# EAGLE design untitled (EAGLE 7.4.0)
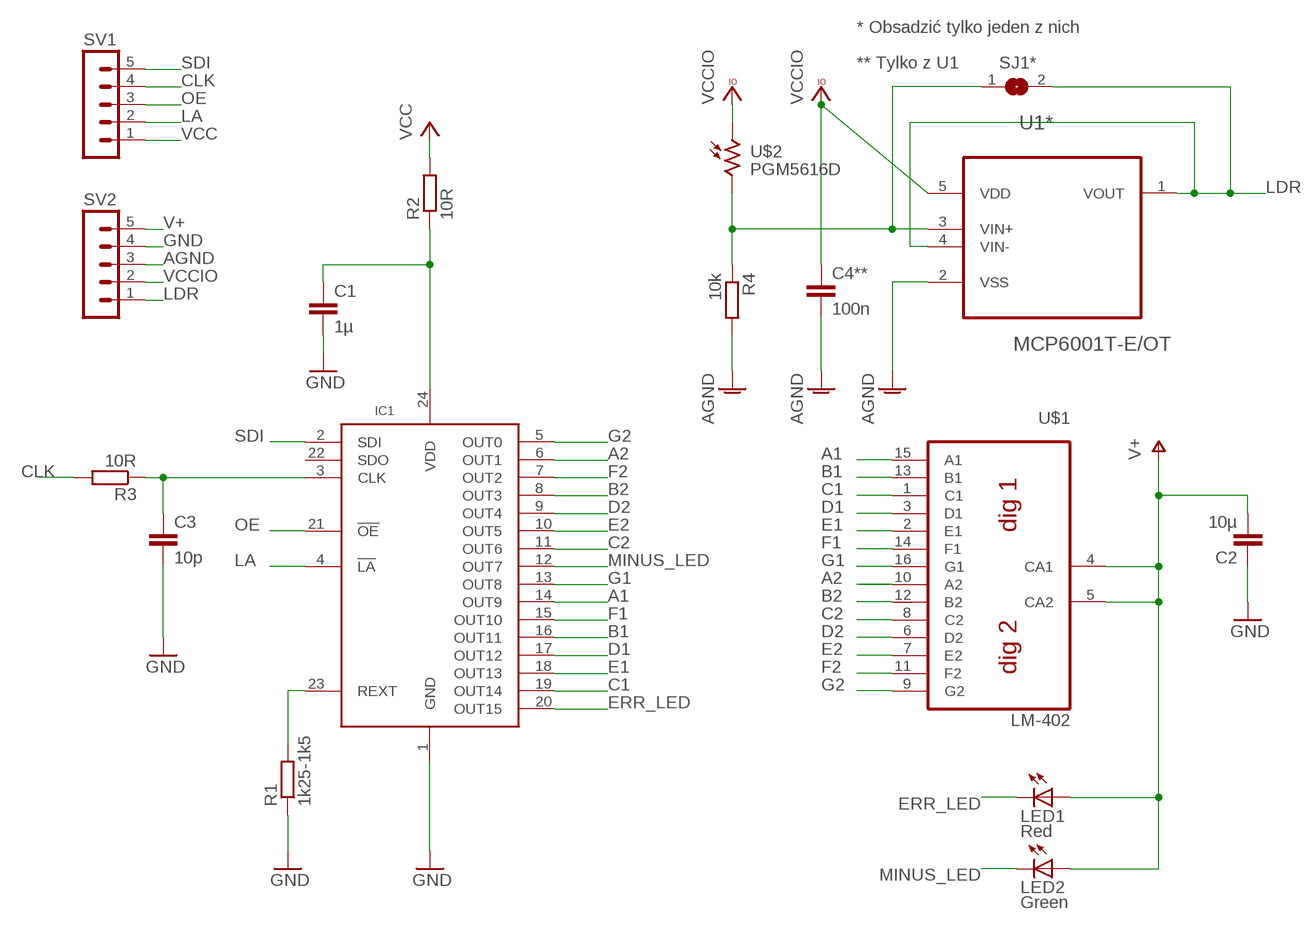
[diagram p0: schematic, sheet 1]

## Parts
C1  1µ  C-EUC0603K  [C0603K]
C2  10µ  C-EUC0603K  [C0603K]
C3  10p  C-EU050-030X075  [C050-030X075]
C4**  100n  C-EUC0603K  [C0603K]
IC1  SCT24  [SSOP24]
LED1  Red  LED3MM  [LED3MM]
LED2  Green  LED3MM  [LED3MM]
R1  1k25-1k5  R-EU_M0805  [M0805]
R2  10R  R-EU_R0805  [R0805]
R3  10R  R-EU_M0805  [M0805]
R4  10k  R-EU_M0805  [M0805]
SJ1*  SJ  [SJ]
SV1  MA05-1  [MA05-1]
SV2  MA05-1  [MA05-1]
U1*  MCP6001T-E/OT  [SOT95P270X145-5N]
U$1  LB-402  [LB-402]
U$2  PGM5616D  [PHOTO_5_34]

## Nets
A1: IC1.14(OUT9) U$1.15(A1)
A2: IC1.6(OUT1) U$1.10(A2)
AGND: C4**.2 R4.2 SV2.3 U1*.2(VSS)
B1: IC1.16(OUT11) U$1.13(B1)
B2: IC1.8(OUT3) U$1.12(B2)
C1: IC1.19(OUT14) U$1.1(C1)
C2: IC1.11(OUT6) U$1.8(C2)
CLK: R3.2 SV1.4
D1: IC1.17(OUT12) U$1.3(D1)
D2: IC1.9(OUT4) U$1.6(D2)
E1: IC1.18(OUT13) U$1.2(E1)
E2: IC1.10(OUT5) U$1.7(E2)
ERR_LED: IC1.20(OUT15) LED1.K(C)
F1: IC1.15(OUT10) U$1.14(F1)
F2: IC1.7(OUT2) U$1.11(F2)
G1: IC1.13(OUT8) U$1.16(G1)
G2: IC1.5(OUT0) U$1.9(G2)
GND: C1.2 C2.1 C3.2 IC1.1(GND) R1.1 SV2.4
LA: IC1.4(!LA) SV1.2
LDR: SJ1*.2 SV2.1 U1*.1(VOUT) U1*.4(VIN-)
MINUS_LED: IC1.12(OUT7) LED2.K(C)
N$1: C1.1 IC1.24(VDD) R2.1
N$2: IC1.23(REXT) R1.2
N$5: C3.1 IC1.3(CLK) R3.1
N$6: R4.1 SJ1*.1 U1*.3(VIN+) U$2.2
OE: IC1.21(!OE) SV1.3
SDI: IC1.2(SDI) SV1.5
V+: C2.2 LED1.A LED2.A SV2.5 U$1.4(CA1) U$1.5(CA2)
VCC: R2.2 SV1.1
VCCIO: C4**.1 SV2.2 U1*.5(VDD) U$2.1
Unconnected: IC1.22(SDO)

## Notes on the sheet
- * Obsadzić tylko jeden z nich
- ** Tylko z U1

## Library data of the parts
C1-C3 C4** = rcl:C-EU: CAPACITOR, European symbol
IC1 = StarChips_:SCT24
LED1 LED2 = adafruit:LED: LED OSRAM: - CHIPLED LG R971, LG N971, LY N971, LG Q971, LY Q971, LO R971, LY R971 LH N974, LH R974 LS Q976, LO Q976, LY Q976 LO Q996 - Hyper CHIPLED LW Q18S LB Q993, LB Q99A, LB R99A - SideLED LS A670, LO A670, LY A670, LG A670, LP A670 LB A673, LV A673, LT A673, LW A673 LH A674 LY A675 LS A676, LA A676, LO A676, LY A676, LW A676 LS A679, LY A679, LG A679 - Hyper Micro SIDELED® LS Y876, LA Y876, LO Y876, LY Y876 LT Y87S - SmartLED LW L88C, LW L88S LB L89C, LB L89S, LG L890 LS L89K, LO L89K, LY L89K LS L896, LA L896, LO L896, LY L896 - TOPLED LS T670, LO T670, LY T670, LG T670, LP T670 LSG T670, LSP T670, LSY T670, LOP T670, LYG T670 LG T671, LOG T671, LSG T671 LB T673, LV T673, LT T673, LW T673 LH T674 LS T676, LA T676, LO T676, LY T676, LB T676, LH T676, LSB T676, LW T676 LB T67C, LV T67C, LT T67C, LS T67K, LO T67K, LY T67K, LW E67C LS E67B, LA E67B, LO E67B, LY E67B, LB E67C, LV E67C, LT E67C LW T67C LS T679, LY T679, LG T679 LS T770, LO T770, LY T770, LG T770, LP T770 LB T773, LV T773, LT T773, LW T773 LH T774 LS E675, LA E675, LY E675, LS T675 LS T776, LA T776, LO T776, LY T776, LB T776 LHGB T686 LT T68C, LB T68C - Hyper Mini TOPLED® LB M676 - Mini TOPLED Santana® LG M470 LS M47K, LO M47K, LY M47K Source: http://www.osram.convergy.de/
R1-R4 = rcl:R-EU_: RESISTOR, European symbol
SJ1* = jumper:SJ: SMD solder JUMPER
SV1 SV2 = con-lstb:MA05-1: PIN HEADER; OC_FARNELL: unknown; OC_NEWARK: unknown
U1* = Microchip_By_element14_Batch_1:MCP6001T-E/OT: 1 MHz, Low-Power Op Amp; MPN: MCP6001T-E/OT; OC_FARNELL: 1332116; OC_NEWARK: 34M7471; PACKAGE: SOT23-5; SUPPLIER: Microchip
U$1 = _biblioteka_1:LB-402: Duble digit LED numeric display without dot. h = 10mm(digit)/16mm(module)
U$2 = _biblioteka_1:PGM5616D

## Board
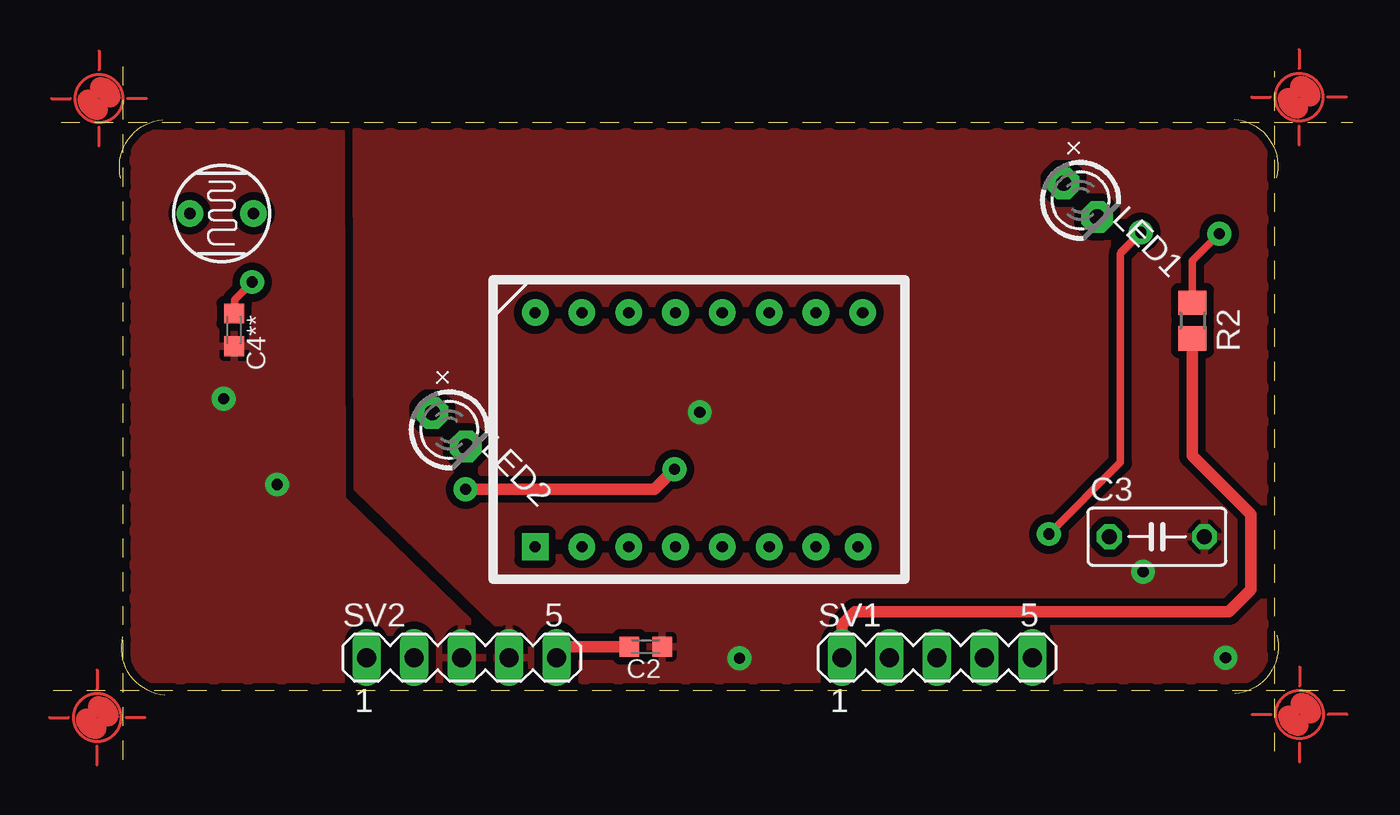
[diagram p1: board, top side]
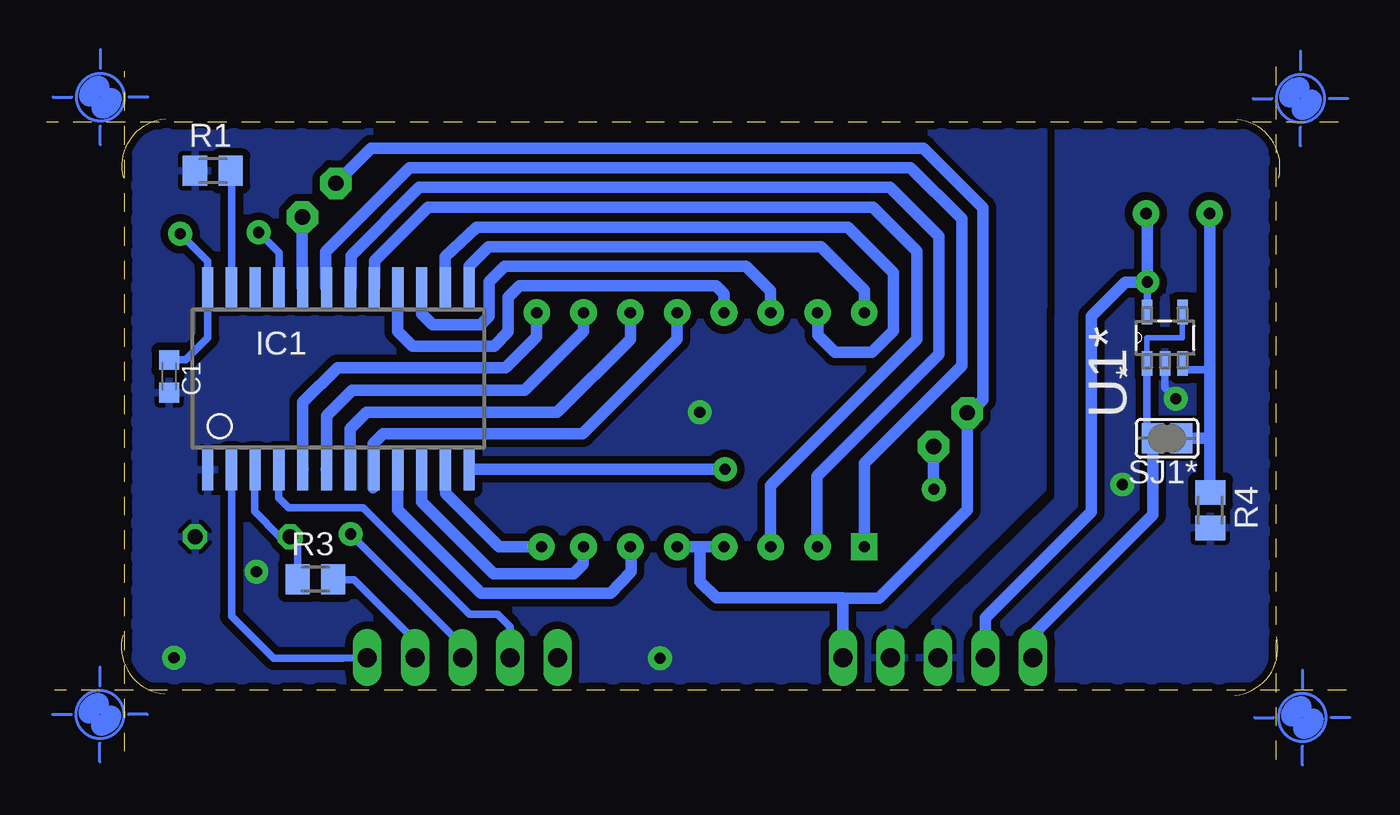
[diagram p2: board, bottom side, seen from below]

Size 69.43 x 37 mm. Coordinates in mm from the lower left corner, seen from the top.
Outline: 63.11,34.2 arc-99 65.35,31.07
Outline: 3.62,31.04 arc-99 5.86,34.18
Outline: 65.38,6.64 arc-99 63.13,3.51
Outline: 5.98,3.44 arc-99 3.73,6.57
Outline: 0,3.69 69,3.69
Outline: 0.43,34.04 69.43,34.04
Outline: 3.75,0 3.75,37
Outline: 65.25,0.44 65.25,36.76
Copper layers (1*16): Top 0.035mm / dielectric 1.5mm / Bottom 0.035mm
Design rules "default *": minimum track width 10mil, minimum drill 24mil, track to track 16mil, track to pad 16mil, pad to pad 8mil, via to via 8mil, smd to smd 8mil, copper to edge 16mil, drill to drill 16mil, minimum pad ring 10mil, minimum via ring 8mil, stop-mask expansion 4mil, vias tented up to drill 0mil, thermal gap 10mil
bKeepout: area 3.8,6.7 to 65.3,8.2

### Footprints (pad centres in the part's own frame; a part is rotated, then mirrored left to right if it is on the bottom)
C0603K = smd 1.05 x 1.08: 1 -0.875,0; 2 0.875,0
C050-030X075 = drill 0.813 octagon: 1 -2.54,0; 2 2.54,0
SSOP24 = smd 0.6 x 2.2: 1 -6.985,-4.854; 2 -5.715,-4.854; 3 -4.445,-4.854; 4 -3.175,-4.854; 5 -1.905,-4.854; 6 -0.635,-4.854; 7 0.635,-4.854; 8 1.905,-4.854; 9 3.175,-4.854; 10 4.445,-4.854; 11 5.715,-4.854; 12 6.985,-4.854; 13 6.985,4.854; 14 5.715,4.854; 15 4.445,4.854; 16 3.175,4.854; 17 1.905,4.854; 18 0.635,4.854; 19 -0.635,4.854; 20 -1.905,4.854; 21 -3.175,4.854; 22 -4.445,4.854; 23 -5.715,4.854; 24 -6.985,4.854
LED3MM = drill 0.813 pad 1.676 octagon: A -1.27,0; K 1.27,0
M0805 = smd 1.3 x 1.6: 1 -0.95,0; 2 0.95,0
R0805 = smd 1.3 x 1.5: 1 -0.95,0; 2 0.95,0
SJ = smd 1.168 x 1.6: 1 -0.762,0; 2 0.762,0
MA05-1 = drill 1.016 long: 1 -5.08,0; 2 -2.54,0; 3 0,0; 4 2.54,0; 5 5.08,0
SOT95P270X145-5N = smd 1.321 x 0.559: 1 -1.372,0.94; 2 -1.372,0; 3 -1.372,-0.94; 4 1.372,-0.94; 5 1.372,0.94
LB-402 = drill 0.6 pad 1.422 square: 1 -8.75,-6.25 | drill 0.6 pad 1.422: 2 -6.25,-6.25; 3 -3.75,-6.25; 4 -1.25,-6.25; 5 1.25,-6.25; 6 3.75,-6.25; 7 6.25,-6.25; 8 8.5,-6.25; 9 8.75,6.25; 10 6.25,6.25; 11 3.75,6.25; 12 1.25,6.25; 13 -1.25,6.25; 14 -3.75,6.25; 15 -6.25,6.25; 16 -8.75,6.25
PHOTO_5_34 = drill 0.6 pad 1.422: 1 -1.7,0; 2 1.7,0

### Placement (x,y rotation side)
C1  62.88,20.47 270 bottom
C2  31.66,6.03 180 top
C3  58.97,11.91 0 top
C4**  9.67,22.95 270 top
DRILEGEND  [DRILEGEND]  -2.99,-6.11 0 top  (outside the outline)
IC1  53.85,20.34 0 bottom
LED1  54.88,29.87 315 top
LED2  21.16,17.62 315 top
R1  60.56,31.44 0 bottom
R2  60.87,23.44 270 top
R3  55.08,9.63 0 bottom
R4  7.27,13.32 270 bottom
SJ1*  9.58,17.15 180 bottom
SV1  47.22,5.44 0 top
SV2  21.82,5.44 0 top
U1*  9.7,22.53 90 bottom
U$1  34.5,17.62 0 top
U$2  9.01,29.17 180 top
U$3  [PASS-ROUND]  2.46,35.3 0 top
U$4  [PASS-ROUND]  66.59,2.42 0 top
U$5  [PASS-ROUND]  66.56,35.37 0 top
U$6  [PASS-ROUND]  2.36,2.25 0 top

### Tracks (layer width: path | path; a pad name or v marks a point on that pad's centre or on a via)
A1
  Bottom 0.61: IC1.14 48.14,26.85 46.47,28.44 26.63,28.44 24.2,26 24.2,22.9 25.34,21.76 27.33,21.76 28.24,22.67 28.24,23.84 U$1.15
A2
  Bottom 0.61: 54.51,15.51 IC1.6 54.48,18.37 53.12,19.73 43.92,19.71 40.75,22.87 U$1.10
AGND  (via drill 0.6 pad 1.27)
  Top 0.406: v9.11,19.27 9.11,19.41
  Bottom 0.406: U1*.2 9.7,19.86 v9.11,19.27
  other vias: 11.97,14.69
  pour Bottom (rank 2): 23.16,3.56 23.23,7.13 19.98,10.19 15.71,14.33 15.78,14.39 15.65,34.1 3.72,34.1 3.68,34.06 3.68,3.49 3.64,3.44 21.32,3.46 21.3,3.44 21.49,3.47
  pour Top (rank 2): 23.15,3.54 23.26,7.17 20.12,10.02 15.83,14.47 15.9,14.61 15.82,34.1 3.89,34.1 3.85,34.06 3.85,3.49 3.81,3.44 21.05,3.49 21.47,3.44 21.67,3.47
B1
  Bottom 0.61: U$1.13 33.26,23.86 33.26,24.87 33.68,25.29 44.19,25.29 44.77,24.7 44.77,22.84 45.54,22.08 49.89,22.08 50.67,22.87 IC1.16
B2
  Bottom 0.61: IC1.8 51.99,14.51 51.99,16.87 51.46,17.39 40.8,17.39 35.75,22.44 U$1.12
C1
  Bottom 0.61: 25.79,11.39 U$1.1 25.74,11.37 25.74,15.84 20.55,21.03 20.55,28.87 23.29,31.61 50.04,31.61 54.52,27.13 54.52,25.23 IC1.19
C2
  Bottom 0.61: IC1.11 48.13,14.22 45.27,11.36 43.02,11.36 U$1.8
CLK
  Bottom 0.406: R3.2 54.4,9.62 53.64,9.62 53.63,9.6 53.01,9.6 49.76,6.35 SV1.4
D1
  Bottom 0.61: 51.95,25.67 IC1.17 51.92,25.22 51.92,26.65 49.06,29.5 25.29,29.5 22.95,27.16 22.95,22.44 30.77,14.62 30.77,11.37 U$1.3
D2
  Bottom 0.61: U$1.6 38.23,11.34 38.23,10.04 39.32,8.89 46.23,8.89 50.67,13.34 IC1.9
E1
  Bottom 0.61: U$1.2 28.28,11.38 28.28,15.13 21.77,21.64 21.77,27.95 24.38,30.56 49.53,30.56 53.18,26.92 53.18,25.23 IC1.18
E2
  Bottom 0.61: U$1.7 40.77,11.35 40.77,10.42 41.28,9.92 45.56,9.92 49.4,13.76 IC1.10
ERR_LED
  Bottom 0.61: LED1.K 55.78,25.22 IC1.20
F1
  Bottom 0.61: U$1.14 30.77,23.86 30.77,25.05 32.07,26.36 44.97,26.36 45.81,25.52 45.8,25.51 45.8,23.68 46.26,23.23 48.81,23.23 49.4,23.82 IC1.15
F2
  Bottom 0.61: IC1.7 53.23,15.51 53.23,17.66 52.34,18.55 42.16,18.55 38.25,22.46 U$1.11
G1
  Bottom 0.61: IC1.13 46.87,26.35 45.82,27.39 28.06,27.39 25.74,25.07 25.74,23.87 U$1.16
G2
  Bottom 0.61: 55.73,15.52 IC1.5 55.76,19.08 53.9,20.94 44.92,20.92 43.25,22.58 U$1.9
GND  (via drill 0.6 pad 1.27)
  other vias: 36.66,5.42 62.63,5.44 58.23,10.03 34.54,18.55
  pour Top: 23.69,3.64 23.8,7.17 16.24,14.48 16.18,33.8 16.26,33.88 65.18,33.88 65.18,3.73 23.95,3.61
  pour Bottom: 23.62,4.26 23.65,7.14 16.21,14.47 16.18,33.73 16.26,33.81 65.18,33.81 65.18,3.66 23.6,3.65
LA
  Bottom 0.406: IC1.4 57.03,13.98 56.51,13.46 52.54,13.46 46.84,7.76 45.36,7.76 45.36,7.77 44.68,7.09 SV1.2 | SV1.2
LDR
  Bottom 0.305: U1*.4 8.77,22.54 10.66,22.54 10.65,21.16 U1*.1 10.67,21.13
  Bottom 0.406: 10.67,21.13 10.67,17.47 SJ1*.2
  Bottom 0.61: SV2.1 16.74,6.68 10.34,13.08 SJ1*.2
MINUS_LED  (via drill 0.6 pad 1.27)
  Top 0.61: v22.03,14.44 32.13,14.44 v33.19,15.5
  Bottom 0.61: LED2.K 22.06,14.46 v22.03,14.44 | v33.19,15.5 46.85,15.5 IC1.12
N$1  (via drill 0.6 pad 1.27)
  Top 0.406: v62.3,28.08 60.86,26.63 60.86,24.41 R2.1
  Bottom 0.406: v62.3,28.08 60.83,26.61 IC1.24 60.82,25.19 60.82,22.53 62.01,21.34 C1.1
N$2
  Bottom 0.406: 59.6,25.23 IC1.23 59.56,31.4 R1.2
N$3
  Bottom 0.61: 8.85,17.08 10.39,17.08 10.46,16.76
N$5
  Bottom 0.406: IC1.3 58.34,15.45 58.34,13.25 56.99,11.91 C3.1 56.03,11.51 R3.1
N$6
  Bottom 0.406: 7.31,20.82 8.76,20.82 U1*.3
  Bottom 0.61: U$2.2 7.31,20.82 7.31,17.27 | 7.31,17.27 7.31,14.31 R4.1 | SJ1*.1 7.43,17.15 7.31,17.27
OE  (via drill 0.6 pad 1.27)
  Top 0.406: 57.04,27.08 v58.11,28.15 58.11,28.11 57.02,27.03 57.02,15.87 v53.2,12.05
  Bottom 0.406: v58.11,28.15 57.02,27.07 IC1.21 | SV1.3 47.22,6.07 v53.2,12.05
SDI
  Bottom 0.406: IC1.2 59.56,7.67 57.31,5.41 53.61,5.41 SV1.5
V+
  Top 0.61: C2.2 27.49,6.03 SV2.5
  Bottom 0.61: LED1.A 52.11,32.64 22.59,32.64 19.42,29.46 19.42,19.21 20.12,18.5 LED2.A 20.24,17.31 20.24,13.35 24.98,8.61 26.9,8.61 | U$1.5 34.54,11.37 | 34.54,11.37 U$1.4 | 34.54,11.37 34.54,9.51 33.66,8.63 26.92,8.63 26.9,8.61 | SV2.5 26.9,8.61
VCC
  Top 0.61: R2.2 60.87,16.24 64,13.11 64,9.06 62.82,7.89 42.83,7.89 42.14,7.2 SV1.1
VCCIO  (via drill 0.6 pad 1.27)
  Top 0.406: C4**.1 9.7,24.56 v10.64,25.5
  Bottom 0.305: 10.64,25.67 v10.64,25.5
  Bottom 0.406: v10.64,25.5 U1*.5
  Bottom 0.61: U$2.1 10.64,29.17 v10.64,25.5 11.8,25.5 13.64,23.67 13.64,13.23 19.28,7.58 SV2.2

### Text on the board
Document: top poziomego pcb | top wsporników | oś goldpinów | dół pcb
Opisy: LDR | V+LDR | AGND | GND | V+LED | VCC | LA | OE | CLK | SDI
DrillLegend: LAYER-STACK
DrillLegend_01-16: 01-16